# Altium project MP3Player.PrjPCB
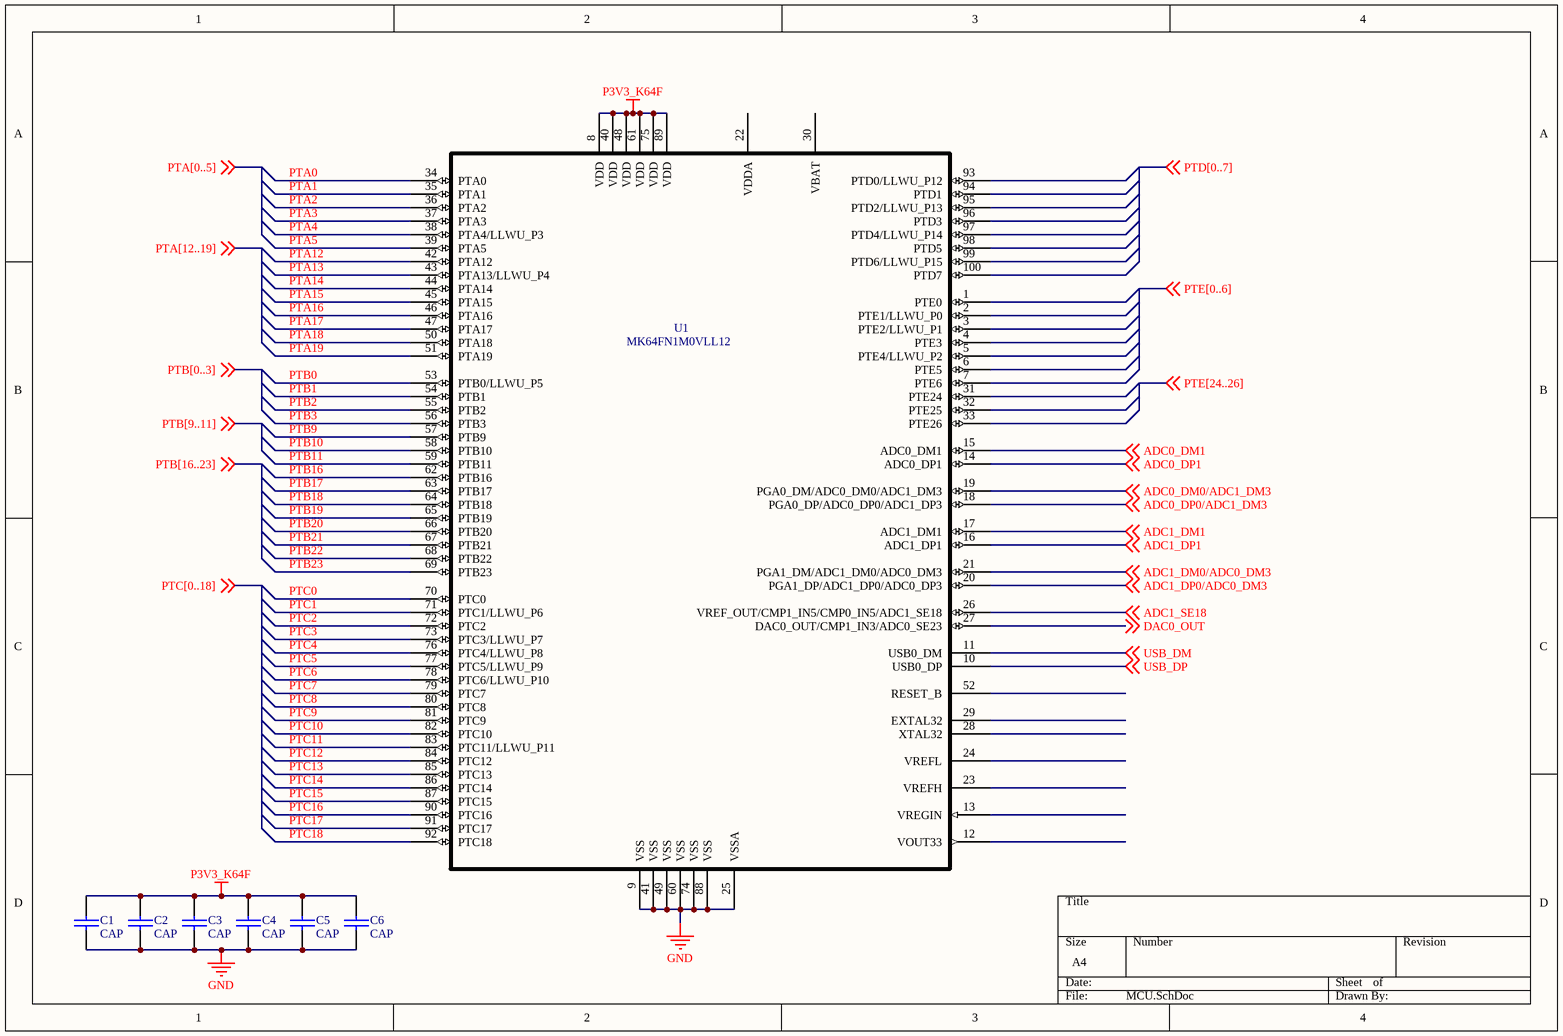
[diagram p0: MCU.SchDoc]
5 sheets, 39 parts. Net scope: global (net labels, ports and power ports of the same name join across sheets).
Sheets:
  MCU.SchDoc
  MicroSD.SchDoc
  MP3Player.SchDoc
  Source.SchDoc
  USB.SchDoc

## Sheet MCU.SchDoc
size A4

### Parts
C1  CAP  [0805]
C2  CAP  [0805]
C3  CAP  [0805]
C4  CAP  [0805]
C5  CAP  [0805]
C6  CAP  [0805]
U1  MK64FN1M0VLL12  [LQFP-100_14X14X1]

### Nets
GND: C1.2 C2.2 C3.2 C4.2 C5.2 C6.2 U1.9(VSS) U1.25(VSSA) U1.41(VSS) U1.49(VSS) U1.60(VSS) U1.74(VSS) U1.88(VSS)
P3V3_K64F: C1.1 C2.1 C3.1 C4.1 C5.1 C6.1 U1.8(VDD) U1.40(VDD) U1.48(VDD) U1.61(VDD) U1.75(VDD) U1.89(VDD)
ADC0_DM0/ADC1_DM3: U1.19(PGA0_DM/ADC0_DM0/ADC1_DM3) ; off-sheet ADC0_DM0/ADC1_DM3
ADC0_DM1: U1.15(ADC0_DM1) ; off-sheet ADC0_DM1
ADC0_DP0/ADC1_DM3: U1.18(PGA0_DP/ADC0_DP0/ADC1_DP3) ; off-sheet ADC0_DP0/ADC1_DM3
ADC0_DP1: U1.14(ADC0_DP1) ; off-sheet ADC0_DP1
ADC1_DM0/ADC0_DM3: U1.21(PGA1_DM/ADC1_DM0/ADC0_DM3) ; off-sheet ADC1_DM0/ADC0_DM3
ADC1_DM1: U1.17(ADC1_DM1) ; off-sheet ADC1_DM1
ADC1_DP0/ADC0_DM3: U1.20(PGA1_DP/ADC1_DP0/ADC0_DP3) ; off-sheet ADC1_DP0/ADC0_DM3
ADC1_DP1: U1.16(ADC1_DP1) ; off-sheet ADC1_DP1
ADC1_SE18: U1.26(VREF_OUT/CMP1_IN5/CMP0_IN5/ADC1_SE18) ; off-sheet ADC1_SE18
DAC0_OUT: U1.27(DAC0_OUT/CMP1_IN3/ADC0_SE23) ; off-sheet DAC0_OUT
PTA0: U1.34(PTA0)
PTA1: U1.35(PTA1)
PTA2: U1.36(PTA2)
PTA3: U1.37(PTA3)
PTA4: U1.38(PTA4/LLWU_P3)
PTA5: U1.39(PTA5)
PTA12: U1.42(PTA12)
PTA13: U1.43(PTA13/LLWU_P4)
PTA14: U1.44(PTA14)
PTA15: U1.45(PTA15)
PTA16: U1.46(PTA16)
PTA17: U1.47(PTA17)
PTA18: U1.50(PTA18)
PTA19: U1.51(PTA19)
PTB0: U1.53(PTB0/LLWU_P5)
PTB1: U1.54(PTB1)
PTB2: U1.55(PTB2)
PTB3: U1.56(PTB3)
PTB9: U1.57(PTB9)
PTB10: U1.58(PTB10)
PTB11: U1.59(PTB11)
PTB16: U1.62(PTB16)
PTB17: U1.63(PTB17)
PTB18: U1.64(PTB18)
PTB19: U1.65(PTB19)
PTB20: U1.66(PTB20)
PTB21: U1.67(PTB21)
PTB22: U1.68(PTB22)
PTB23: U1.69(PTB23)
PTC0: U1.70(PTC0)
PTC1: U1.71(PTC1/LLWU_P6)
PTC2: U1.72(PTC2)
PTC3: U1.73(PTC3/LLWU_P7)
PTC4: U1.76(PTC4/LLWU_P8)
PTC5: U1.77(PTC5/LLWU_P9)
PTC6: U1.78(PTC6/LLWU_P10)
PTC7: U1.79(PTC7)
PTC8: U1.80(PTC8)
PTC9: U1.81(PTC9)
PTC10: U1.82(PTC10)
PTC11: U1.83(PTC11/LLWU_P11)
PTC12: U1.84(PTC12)
PTC13: U1.85(PTC13)
PTC14: U1.86(PTC14)
PTC15: U1.87(PTC15)
PTC16: U1.90(PTC16)
PTC17: U1.91(PTC17)
PTC18: U1.92(PTC18)
USB_DM: U1.11(USB0_DM) ; off-sheet USB_DM
USB_DP: U1.10(USB0_DP) ; off-sheet USB_DP

Not connected (* = marked no-connect by the designer): U1 1(PTE0) 2(PTE1/LLWU_P0) 3(PTE2/LLWU_P1) 4(PTE3) 5(PTE4/LLWU_P2) 6(PTE5) 7(PTE6) 12(VOUT33) 13(VREGIN) 22(VDDA) 23(VREFH) 24(VREFL) 28(XTAL32) 29(EXTAL32) 30(VBAT) 31(PTE24) 32(PTE25) 33(PTE26) 52(RESET_B) 93(PTD0/LLWU_P12) 94(PTD1) 95(PTD2/LLWU_P13) 96(PTD3) 97(PTD4/LLWU_P14) 98(PTD5) 99(PTD6/LLWU_P15) 100(PTD7)

### Library data of the parts
U1 = MK64FN1M0VLL12: Imported; Vendor: FREESCALE; CPU: ARM Cortex-M4F; Max_Frequency: 120; Flash_KB: 1024; SRAM_KB: 256; Pin_Count: 100; Manufacturer_Part_Number: mk64fn1m0vll12; Package: LQFP; RefDes: RefDes; Type: Type; Value: Value

## Sheet MicroSD.SchDoc
size A4
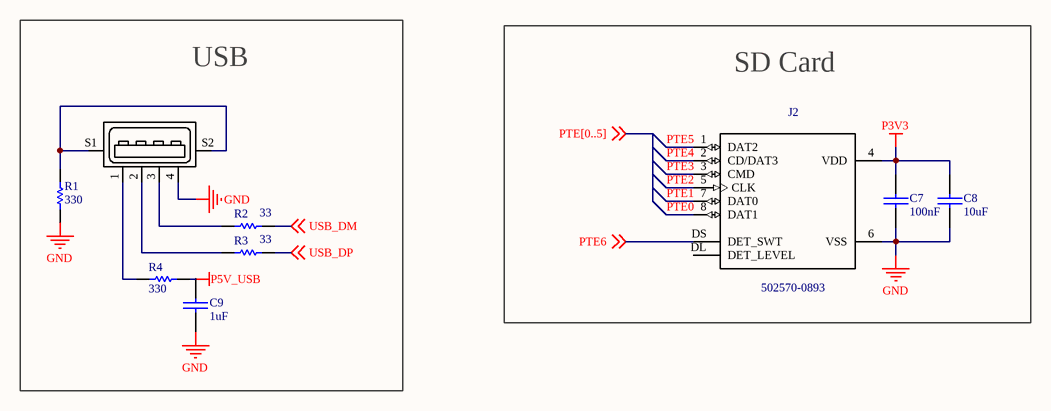
[diagram p1: MicroSD.SchDoc]

### Parts
C7  100nF  [0805]
C8  10uF  [0805]
C9  1uF  [0805]
J1  UJ2-AH-1-SMT  [CUI_UJ2-AH-1-SMT_UJ2-AH-1-SMT(Primary)]  (value not drawn)
J2  502570-0893  [MOLEX_502570-0893_502570-0893(Primary)]
R1  330  [0805]
R2  33  [0805]
R3  33  [0805]
R4  330  [0805]

### Blocks framed on the sheet
USB: C9 J1 R1-R4
SD Card: C7 C8 J2

### Nets
GND: C7.2 C8.2 C9.2 J1.4 J2.6(VSS) R1.1
P3V3: C7.1 C8.1 J2.4(VDD)
P5V_USB: R4.1
PTE0: J2.8(DAT1)
PTE1: J2.7(DAT0)
PTE2: J2.5(CLK)
PTE3: J2.3(CMD)
PTE4: J2.2(CD/DAT3)
PTE5: J2.1(DAT2)
PTE6: J2.DS(DET_SWT) ; off-sheet PTE6
USB_DM: R2.1 ; off-sheet USB_DM
USB_DP: R3.1 ; off-sheet USB_DP
NetJ1_1: J1.1 R4.2
NetJ1_2: J1.2 R3.2
NetJ1_3: J1.3 R2.2
NetJ1_S1: J1.S1(SHIELD) J1.S2(SHIELD) R1.2

Not connected (* = marked no-connect by the designer): C9 1; J2 DL(DET_LEVEL)

### Library data of the parts
C7-C9 = CAP
J1 = UJ2-AH-1-SMT: Standard A type 4 pin Horizontal 3 Âµin Plating SMT USB 2.0 Jack; MP: UJ2-AH-1-SMT-TR; MF: CUI Inc.; CUI_purchase_URL: https://www.cui.com/product/interconnect/usb-connectors/type-a/uj2-ah-smt-series?utm_source=snapeda.com&utm_medium=referral&utm_campaign=snapedaBOM; Package: None; Availability: Unavailable; SnapEDA_Link: https://www.snapeda.com/parts/UJ2-AH-1-SMT-TR/CUI%20Inc./view-part/?ref=snap; Price: None; Value: *
J2 = 502570-0893: 1.10mm Pitch microSD Memory Card Connector, Normal Mount Surface Mount, Push-Push Type; MF: Molex; Availability: Unavailable; Package: None; SnapEDA_Link: https://www.snapeda.com/parts/502570-0893/Molex/view-part/?ref=snap; MP: 502570-0893; Price: None; Value: *
R1-R4 = RES

## Sheet MP3Player.SchDoc
size A2
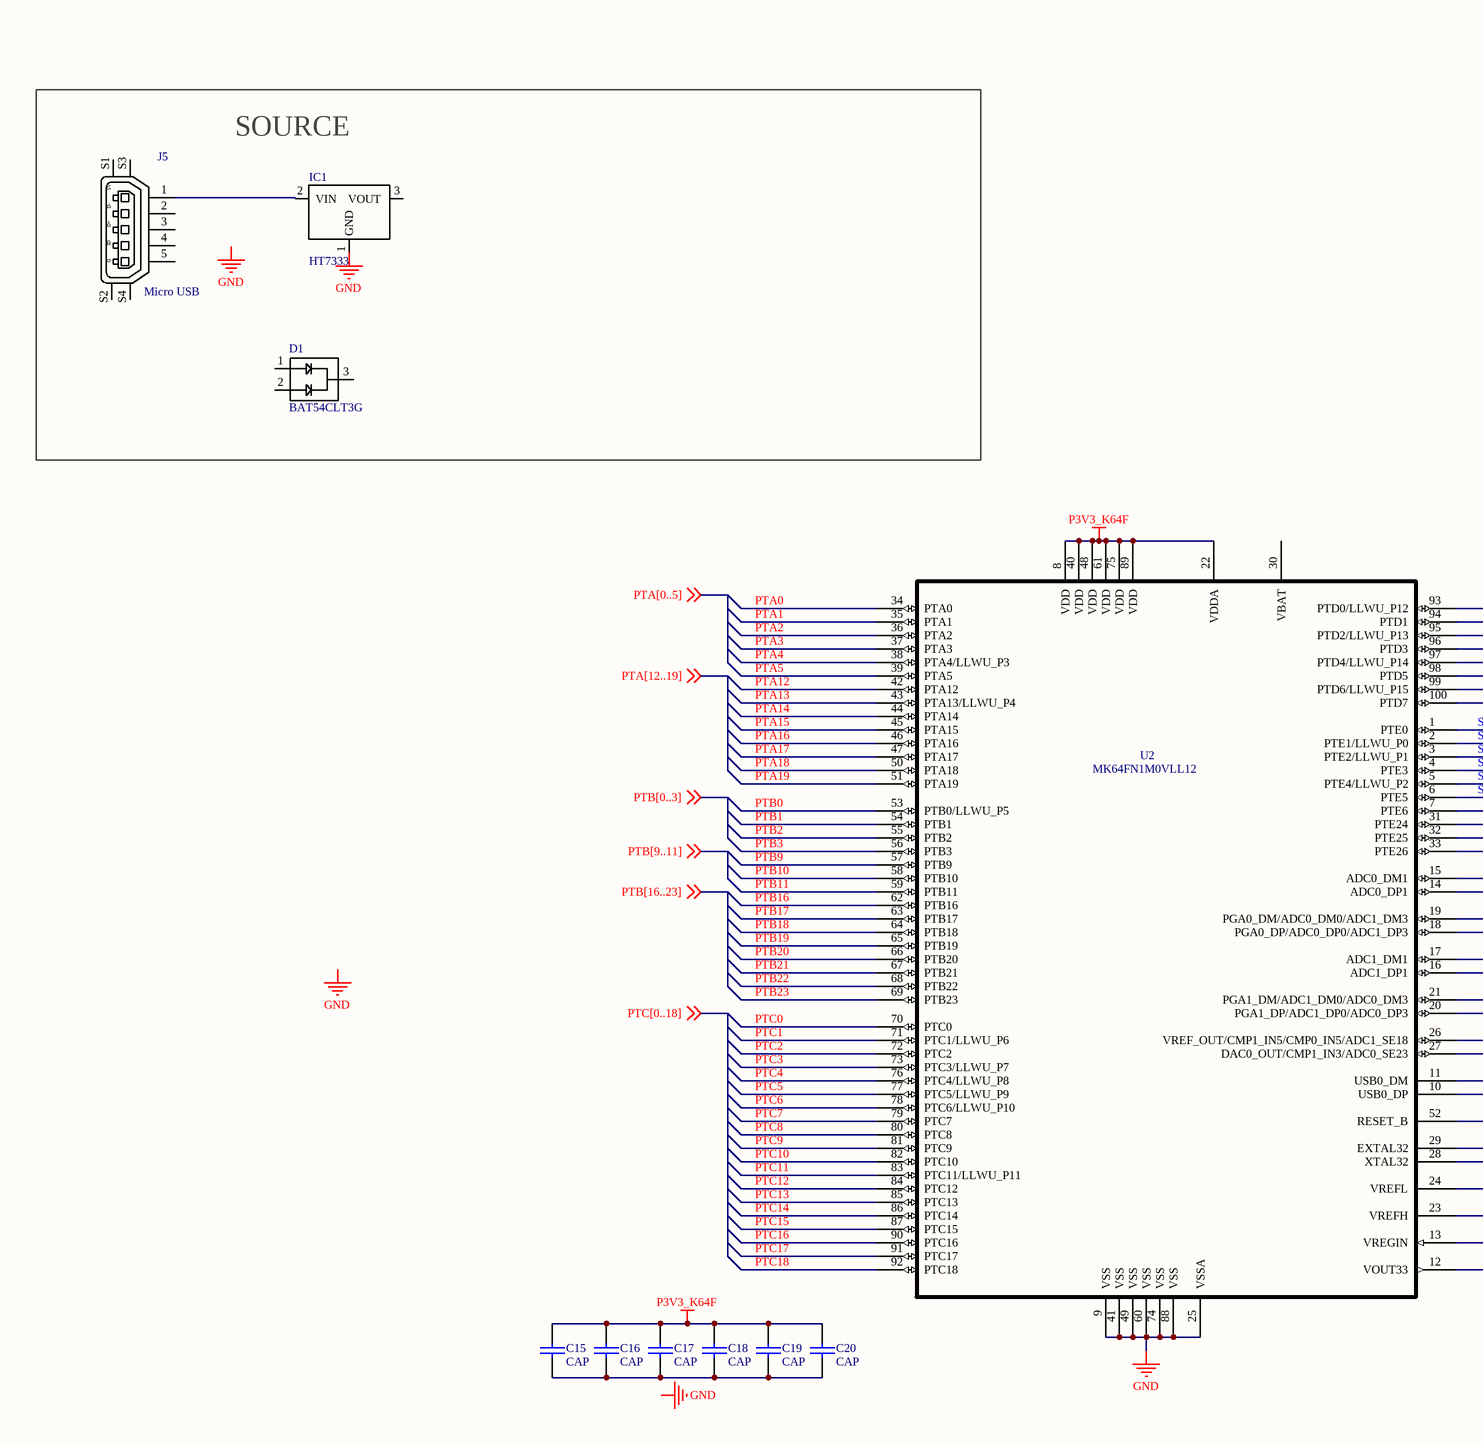
[diagram p2: MP3Player.SchDoc, left]
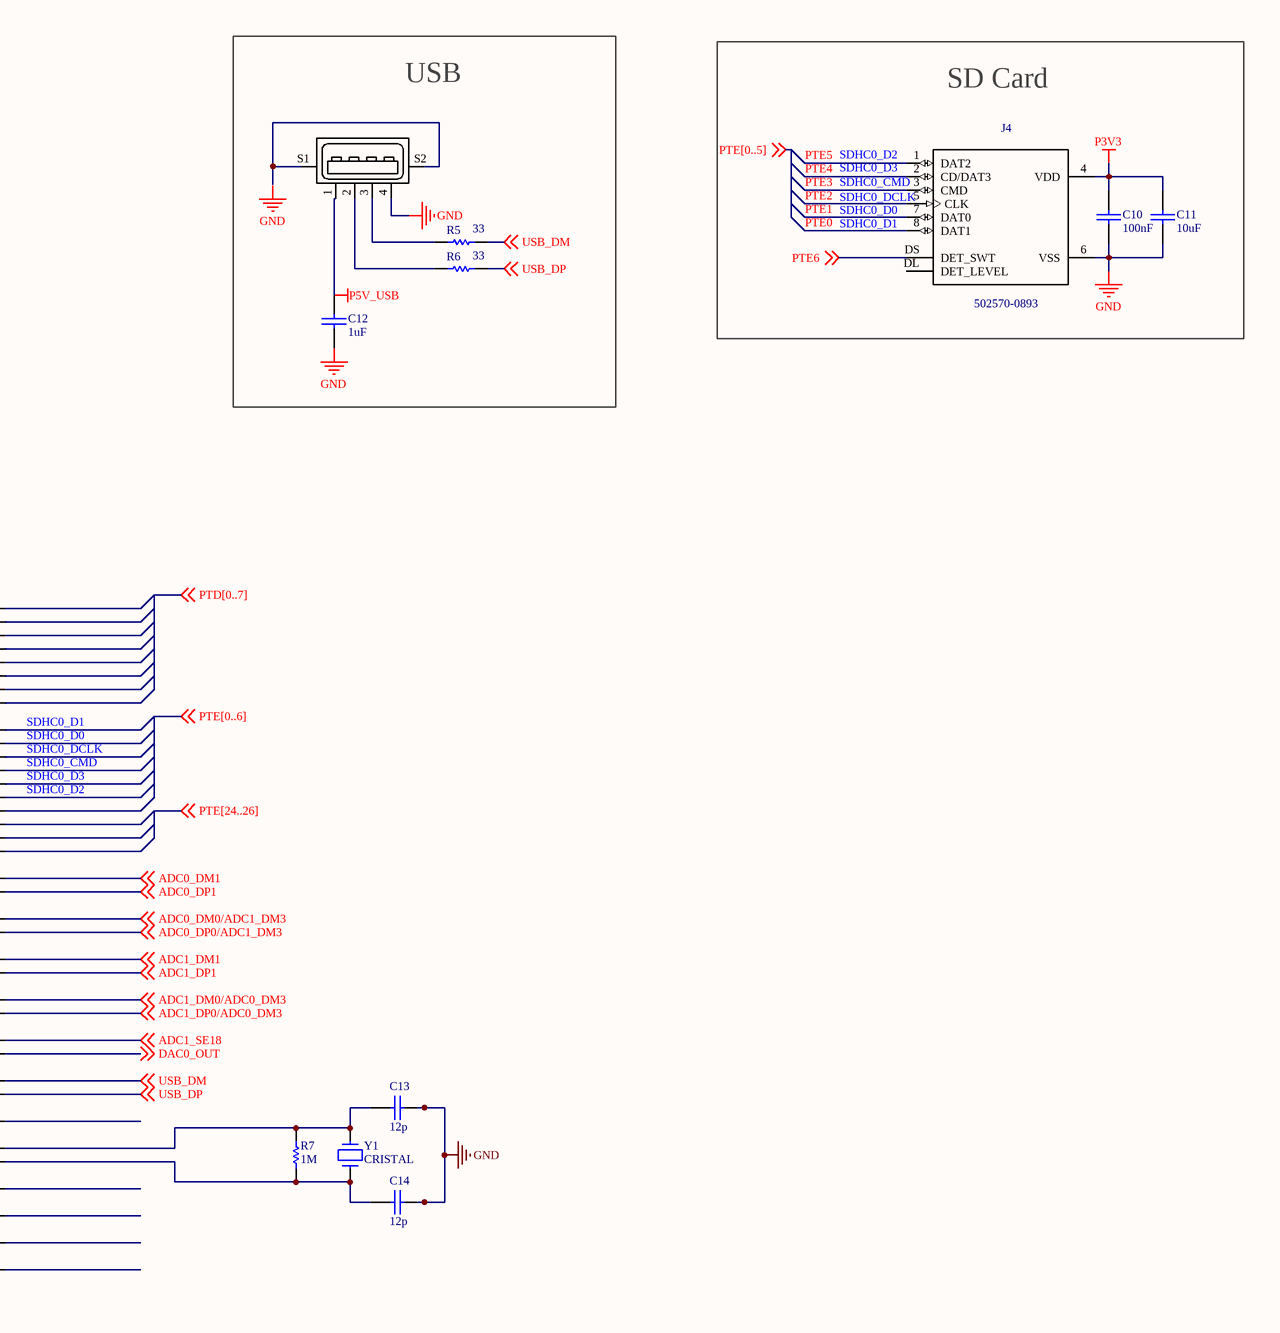
[diagram p3: MP3Player.SchDoc, right]

### Parts
C10  100nF  [0805]
C11  10uF  [0805]
C12  1uF  [0805]
C13  12p  [0805]
C14  12p  [0805]
C15  CAP  [0805]
C16  CAP  [0805]
C17  CAP  [0805]
C18  CAP  [0805]
C19  CAP  [0805]
C20  CAP  [0805]
D1  BAT54CLT3G  [SOT96P237X111-3N]
IC1  HT7333
J3  UJ2-AH-1-SMT  [CUI_UJ2-AH-1-SMT_UJ2-AH-1-SMT(Primary)]  (value not drawn)
J4  502570-0893  [MOLEX_502570-0893_502570-0893(Primary)]
J5  Micro USB  [HRS_ZX62D-B-5P8_ZX62D-B-5P8(Primary)]
R5  33  [0805]
R6  33  [0805]
R7  1M  [RES400]
U2  MK64FN1M0VLL12  [LQFP-100_14X14X1]
Y1  CRISTAL  [CRISTAL PERFIL]

### Blocks framed on the sheet
USB: C12 J3 R5 R6
SD Card: C10 C11 J4
SOURCE: D1 IC1 J5

### Nets
GND: C10.2 C11.2 C12.2 C13.2 C14.2 IC1.1(GND) J3.4 J4.6(VSS) U2.9(VSS) U2.25(VSSA) U2.41(VSS) U2.49(VSS) U2.60(VSS) U2.74(VSS) U2.88(VSS)
P3V3: C10.1 C11.1 J4.4(VDD)
P3V3_K64F: C15.1 C16.1 C17.1 C18.1 C19.1 C20.1 U2.8(VDD) U2.22(VDDA) U2.40(VDD) U2.48(VDD) U2.61(VDD) U2.75(VDD) U2.89(VDD)
ADC0_DM0/ADC1_DM3: U2.19(PGA0_DM/ADC0_DM0/ADC1_DM3) ; off-sheet ADC0_DM0/ADC1_DM3
ADC0_DM1: U2.15(ADC0_DM1) ; off-sheet ADC0_DM1
ADC0_DP0/ADC1_DM3: U2.18(PGA0_DP/ADC0_DP0/ADC1_DP3) ; off-sheet ADC0_DP0/ADC1_DM3
ADC0_DP1: U2.14(ADC0_DP1) ; off-sheet ADC0_DP1
ADC1_DM0/ADC0_DM3: U2.21(PGA1_DM/ADC1_DM0/ADC0_DM3) ; off-sheet ADC1_DM0/ADC0_DM3
ADC1_DM1: U2.17(ADC1_DM1) ; off-sheet ADC1_DM1
ADC1_DP0/ADC0_DM3: U2.20(PGA1_DP/ADC1_DP0/ADC0_DP3) ; off-sheet ADC1_DP0/ADC0_DM3
ADC1_DP1: U2.16(ADC1_DP1) ; off-sheet ADC1_DP1
ADC1_SE18: U2.26(VREF_OUT/CMP1_IN5/CMP0_IN5/ADC1_SE18) ; off-sheet ADC1_SE18
DAC0_OUT: U2.27(DAC0_OUT/CMP1_IN3/ADC0_SE23) ; off-sheet DAC0_OUT
PTA0: U2.34(PTA0)
PTA1: U2.35(PTA1)
PTA2: U2.36(PTA2)
PTA3: U2.37(PTA3)
PTA4: U2.38(PTA4/LLWU_P3)
PTA5: U2.39(PTA5)
PTA12: U2.42(PTA12)
PTA13: U2.43(PTA13/LLWU_P4)
PTA14: U2.44(PTA14)
PTA15: U2.45(PTA15)
PTA16: U2.46(PTA16)
PTA17: U2.47(PTA17)
PTA18: U2.50(PTA18)
PTA19: U2.51(PTA19)
PTB0: U2.53(PTB0/LLWU_P5)
PTB1: U2.54(PTB1)
PTB2: U2.55(PTB2)
PTB3: U2.56(PTB3)
PTB9: U2.57(PTB9)
PTB10: U2.58(PTB10)
PTB11: U2.59(PTB11)
PTB16: U2.62(PTB16)
PTB17: U2.63(PTB17)
PTB18: U2.64(PTB18)
PTB19: U2.65(PTB19)
PTB20: U2.66(PTB20)
PTB21: U2.67(PTB21)
PTB22: U2.68(PTB22)
PTB23: U2.69(PTB23)
PTC0: U2.70(PTC0)
PTC1: U2.71(PTC1/LLWU_P6)
PTC2: U2.72(PTC2)
PTC3: U2.73(PTC3/LLWU_P7)
PTC4: U2.76(PTC4/LLWU_P8)
PTC5: U2.77(PTC5/LLWU_P9)
PTC6: U2.78(PTC6/LLWU_P10)
PTC7: U2.79(PTC7)
PTC8: U2.80(PTC8)
PTC9: U2.81(PTC9)
PTC10: U2.82(PTC10)
PTC11: U2.83(PTC11/LLWU_P11)
PTC12: U2.84(PTC12)
PTC13: U2.85(PTC13)
PTC14: U2.86(PTC14)
PTC15: U2.87(PTC15)
PTC16: U2.90(PTC16)
PTC17: U2.91(PTC17)
PTC18: U2.92(PTC18)
PTE0: J4.8(DAT1)
PTE1: J4.7(DAT0)
PTE2: J4.5(CLK)
PTE3: J4.3(CMD)
PTE4: J4.2(CD/DAT3)
PTE5: J4.1(DAT2)
PTE6: J4.DS(DET_SWT) ; off-sheet PTE6
USB_DM: R5.1 U2.11(USB0_DM) ; off-sheet USB_DM
USB_DP: R6.1 U2.10(USB0_DP) ; off-sheet USB_DP
NetC12_1: C12.1 J3.1
NetC13_1: C13.1 R7.2 U2.29(EXTAL32) Y1.2
NetC14_1: C14.1 R7.1 U2.28(XTAL32) Y1.1
NetC15_2: C15.2 C16.2 C17.2 C18.2 C19.2 C20.2
NetIC1_2: IC1.2(VIN) J5.1
NetJ3_2: J3.2 R6.2
NetJ3_3: J3.3 R5.2
NetJ3_S1: J3.S1(SHIELD) J3.S2(SHIELD)

Not connected (* = marked no-connect by the designer): D1 1(A1) 2(A2) 3(K); IC1 3(VOUT); J4 DL(DET_LEVEL); J5 2 3 4 5 S1(SHIELD) S2(SHIELD) S3(SHIELD) S4(SHIELD); U2 1(PTE0) 2(PTE1/LLWU_P0) 3(PTE2/LLWU_P1) 4(PTE3) 5(PTE4/LLWU_P2) 6(PTE5) 7(PTE6) 12(VOUT33) 13(VREGIN) 23(VREFH) 24(VREFL) 30(VBAT) 31(PTE24) 32(PTE25) 33(PTE26) 52(RESET_B) 93(PTD0/LLWU_P12) 94(PTD1) 95(PTD2/LLWU_P13) 96(PTD3) 97(PTD4/LLWU_P14) 98(PTD5) 99(PTD6/LLWU_P15) 100(PTD7)

### Notes on the sheet
- (near J4) SDHC0_D3
- (near J4) SDHC0_D2
- (near J4) SDHC0_D0
- (near J4) SDHC0_DCLK
- (near J4) SDHC0_CMD
- (near J4) SDHC0_D1
- SDHC0_D1
- SDHC0_D0
- SDHC0_DCLK
- SDHC0_CMD
- SDHC0_D3
- SDHC0_D2
- Labels drawn without touching a wire or pin: GND, P5V_USB
- (in symbol ZX62D-B-5P8) G         ID         D+        D-         5V

### Library data of the parts
C10-C14 = CAP
D1 = BAT54CLT3G: Manufacturer_Name: ON Semiconductor; Geometry.Height: 1.11mm; Mouser Part Number: 863-BAT54CLT3G; Manufacturer_Part_Number: BAT54CLT3G; Datasheet Link: https://componentsearchengine.com/Datasheets/1/BAT54CLT3G.pdf
IC1 = HT7333: Micropower Voltage  Regulator
J3 = UJ2-AH-1-SMT: as J1 on sheet MicroSD; CUI_purchase_URL: https://www.cui.com/product/interconnect/usb-connectors/type-a/uj2-ah-smt-series?utm_source=snapeda.com&utm_medium=referral&utm_campaign=snapedaBOM; Package: None; Availability: Unavailable; SnapEDA_Link: https://www.snapeda.com/parts/UJ2-AH-1-SMT-TR/CUI%20Inc./view-part/?ref=snap; Price: None; Value: *
J4 = 502570-0893: as J2 on sheet MicroSD; Availability: Unavailable; Package: None; SnapEDA_Link: https://www.snapeda.com/parts/502570-0893/Molex/view-part/?ref=snap; MP: 502570-0893; Price: None; Value: *
J5 = ZX62D-B-5P8: SMD+DIP Micro USB; MICRO-B-SMD; MF: Hirose; Package: None; Price: None; Availability: Unavailable; MP: ZX62D-B-5P8; SnapEDA_Link: https://www.snapeda.com/parts/ZX62D-B-5P8/Hirose%20Electric%20Co%20Ltd/view-part/?ref=snap; Value: *
R5-R7 = RES
U2 = MK64FN1M0VLL12: as U1 on sheet MCU; Manufacturer_Part_Number: mk64fn1m0vll12; Package: LQFP; RefDes: RefDes; Type: Type; Value: Value

## Sheet Source.SchDoc
size A4
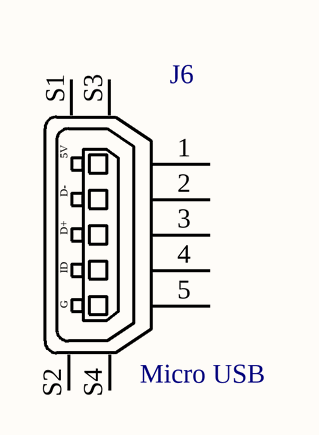
[diagram p4: Source.SchDoc]

### Parts
J6  Micro USB  [HRS_ZX62D-B-5P8_ZX62D-B-5P8(Primary)]

### Nets

Not connected (* = marked no-connect by the designer): J6 1 2 3 4 5 S1(SHIELD) S2(SHIELD) S3(SHIELD) S4(SHIELD)

### Notes on the sheet
- (in symbol ZX62D-B-5P8) G         ID         D+        D-         5V

### Library data of the parts
J6 = ZX62D-B-5P8: as J5 on sheet MP3Player; Package: None; Price: None; Availability: Unavailable; MP: ZX62D-B-5P8; SnapEDA_Link: https://www.snapeda.com/parts/ZX62D-B-5P8/Hirose%20Electric%20Co%20Ltd/view-part/?ref=snap; Value: *

## Sheet USB.SchDoc
size A4
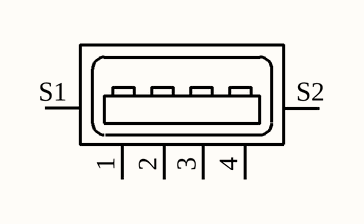
[diagram p5: USB.SchDoc]

### Parts
J7  UJ2-AH-1-SMT  [CUI_UJ2-AH-1-SMT_UJ2-AH-1-SMT(Primary)]  (value not drawn)

### Nets

Not connected (* = marked no-connect by the designer): J7 1 2 3 4 S1(SHIELD) S2(SHIELD)

### Library data of the parts
J7 = UJ2-AH-1-SMT: as J1 on sheet MicroSD; CUI_purchase_URL: https://www.cui.com/product/interconnect/usb-connectors/type-a/uj2-ah-smt-series?utm_source=snapeda.com&utm_medium=referral&utm_campaign=snapedaBOM; Package: None; Availability: Unavailable; SnapEDA_Link: https://www.snapeda.com/parts/UJ2-AH-1-SMT-TR/CUI%20Inc./view-part/?ref=snap; Price: None; Value: *

## Nets that join several sheets
GND: MCU (13 pins), MicroSD (6 pins), MP3Player (15 pins)
P3V3: MicroSD (C7.1 C8.1 J2.4), MP3Player (C10.1 C11.1 J4.4)
P3V3_K64F: MCU (12 pins), MP3Player (13 pins)
ADC0_DM0/ADC1_DM3: MCU (U1.19), MP3Player (U2.19)
ADC0_DM1: MCU (U1.15), MP3Player (U2.15)
ADC0_DP0/ADC1_DM3: MCU (U1.18), MP3Player (U2.18)
ADC0_DP1: MCU (U1.14), MP3Player (U2.14)
ADC1_DM0/ADC0_DM3: MCU (U1.21), MP3Player (U2.21)
ADC1_DM1: MCU (U1.17), MP3Player (U2.17)
ADC1_DP0/ADC0_DM3: MCU (U1.20), MP3Player (U2.20)
ADC1_DP1: MCU (U1.16), MP3Player (U2.16)
ADC1_SE18: MCU (U1.26), MP3Player (U2.26)
DAC0_OUT: MCU (U1.27), MP3Player (U2.27)
PTA0: MCU (U1.34), MP3Player (U2.34)
PTA1: MCU (U1.35), MP3Player (U2.35)
PTA2: MCU (U1.36), MP3Player (U2.36)
PTA3: MCU (U1.37), MP3Player (U2.37)
PTA4: MCU (U1.38), MP3Player (U2.38)
PTA5: MCU (U1.39), MP3Player (U2.39)
PTA12: MCU (U1.42), MP3Player (U2.42)
PTA13: MCU (U1.43), MP3Player (U2.43)
PTA14: MCU (U1.44), MP3Player (U2.44)
PTA15: MCU (U1.45), MP3Player (U2.45)
PTA16: MCU (U1.46), MP3Player (U2.46)
PTA17: MCU (U1.47), MP3Player (U2.47)
PTA18: MCU (U1.50), MP3Player (U2.50)
PTA19: MCU (U1.51), MP3Player (U2.51)
PTB0: MCU (U1.53), MP3Player (U2.53)
PTB1: MCU (U1.54), MP3Player (U2.54)
PTB2: MCU (U1.55), MP3Player (U2.55)
PTB3: MCU (U1.56), MP3Player (U2.56)
PTB9: MCU (U1.57), MP3Player (U2.57)
PTB10: MCU (U1.58), MP3Player (U2.58)
PTB11: MCU (U1.59), MP3Player (U2.59)
PTB16: MCU (U1.62), MP3Player (U2.62)
PTB17: MCU (U1.63), MP3Player (U2.63)
PTB18: MCU (U1.64), MP3Player (U2.64)
PTB19: MCU (U1.65), MP3Player (U2.65)
PTB20: MCU (U1.66), MP3Player (U2.66)
PTB21: MCU (U1.67), MP3Player (U2.67)
PTB22: MCU (U1.68), MP3Player (U2.68)
PTB23: MCU (U1.69), MP3Player (U2.69)
PTC0: MCU (U1.70), MP3Player (U2.70)
PTC1: MCU (U1.71), MP3Player (U2.71)
PTC2: MCU (U1.72), MP3Player (U2.72)
PTC3: MCU (U1.73), MP3Player (U2.73)
PTC4: MCU (U1.76), MP3Player (U2.76)
PTC5: MCU (U1.77), MP3Player (U2.77)
PTC6: MCU (U1.78), MP3Player (U2.78)
PTC7: MCU (U1.79), MP3Player (U2.79)
PTC8: MCU (U1.80), MP3Player (U2.80)
PTC9: MCU (U1.81), MP3Player (U2.81)
PTC10: MCU (U1.82), MP3Player (U2.82)
PTC11: MCU (U1.83), MP3Player (U2.83)
PTC12: MCU (U1.84), MP3Player (U2.84)
PTC13: MCU (U1.85), MP3Player (U2.85)
PTC14: MCU (U1.86), MP3Player (U2.86)
PTC15: MCU (U1.87), MP3Player (U2.87)
PTC16: MCU (U1.90), MP3Player (U2.90)
PTC17: MCU (U1.91), MP3Player (U2.91)
PTC18: MCU (U1.92), MP3Player (U2.92)
PTE0: MicroSD (J2.8), MP3Player (J4.8)
PTE1: MicroSD (J2.7), MP3Player (J4.7)
PTE2: MicroSD (J2.5), MP3Player (J4.5)
PTE3: MicroSD (J2.3), MP3Player (J4.3)
PTE4: MicroSD (J2.2), MP3Player (J4.2)
PTE5: MicroSD (J2.1), MP3Player (J4.1)
PTE6: MicroSD (J2.DS), MP3Player (J4.DS)
USB_DM: MCU (U1.11), MicroSD (R2.1), MP3Player (R5.1 U2.11)
USB_DP: MCU (U1.10), MicroSD (R3.1), MP3Player (R6.1 U2.10)